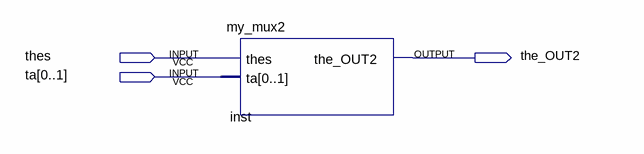
[diagram p0: schematic sheet]
// Quartus schematic week5_main.bdf as structural Verilog: 1 symbols, 3 pins
module week5_main (
  input  thes,
  input  [0:1] ta,
  output the_OUT2
);

  my_mux2 inst (.thes(thes), .ta(ta), .the_OUT2(the_OUT2));
endmodule
